# Altium schematic sheet Resistor - 261-312.SchDoc
size A0; SheetNumber: 7; SheetTotal: 14
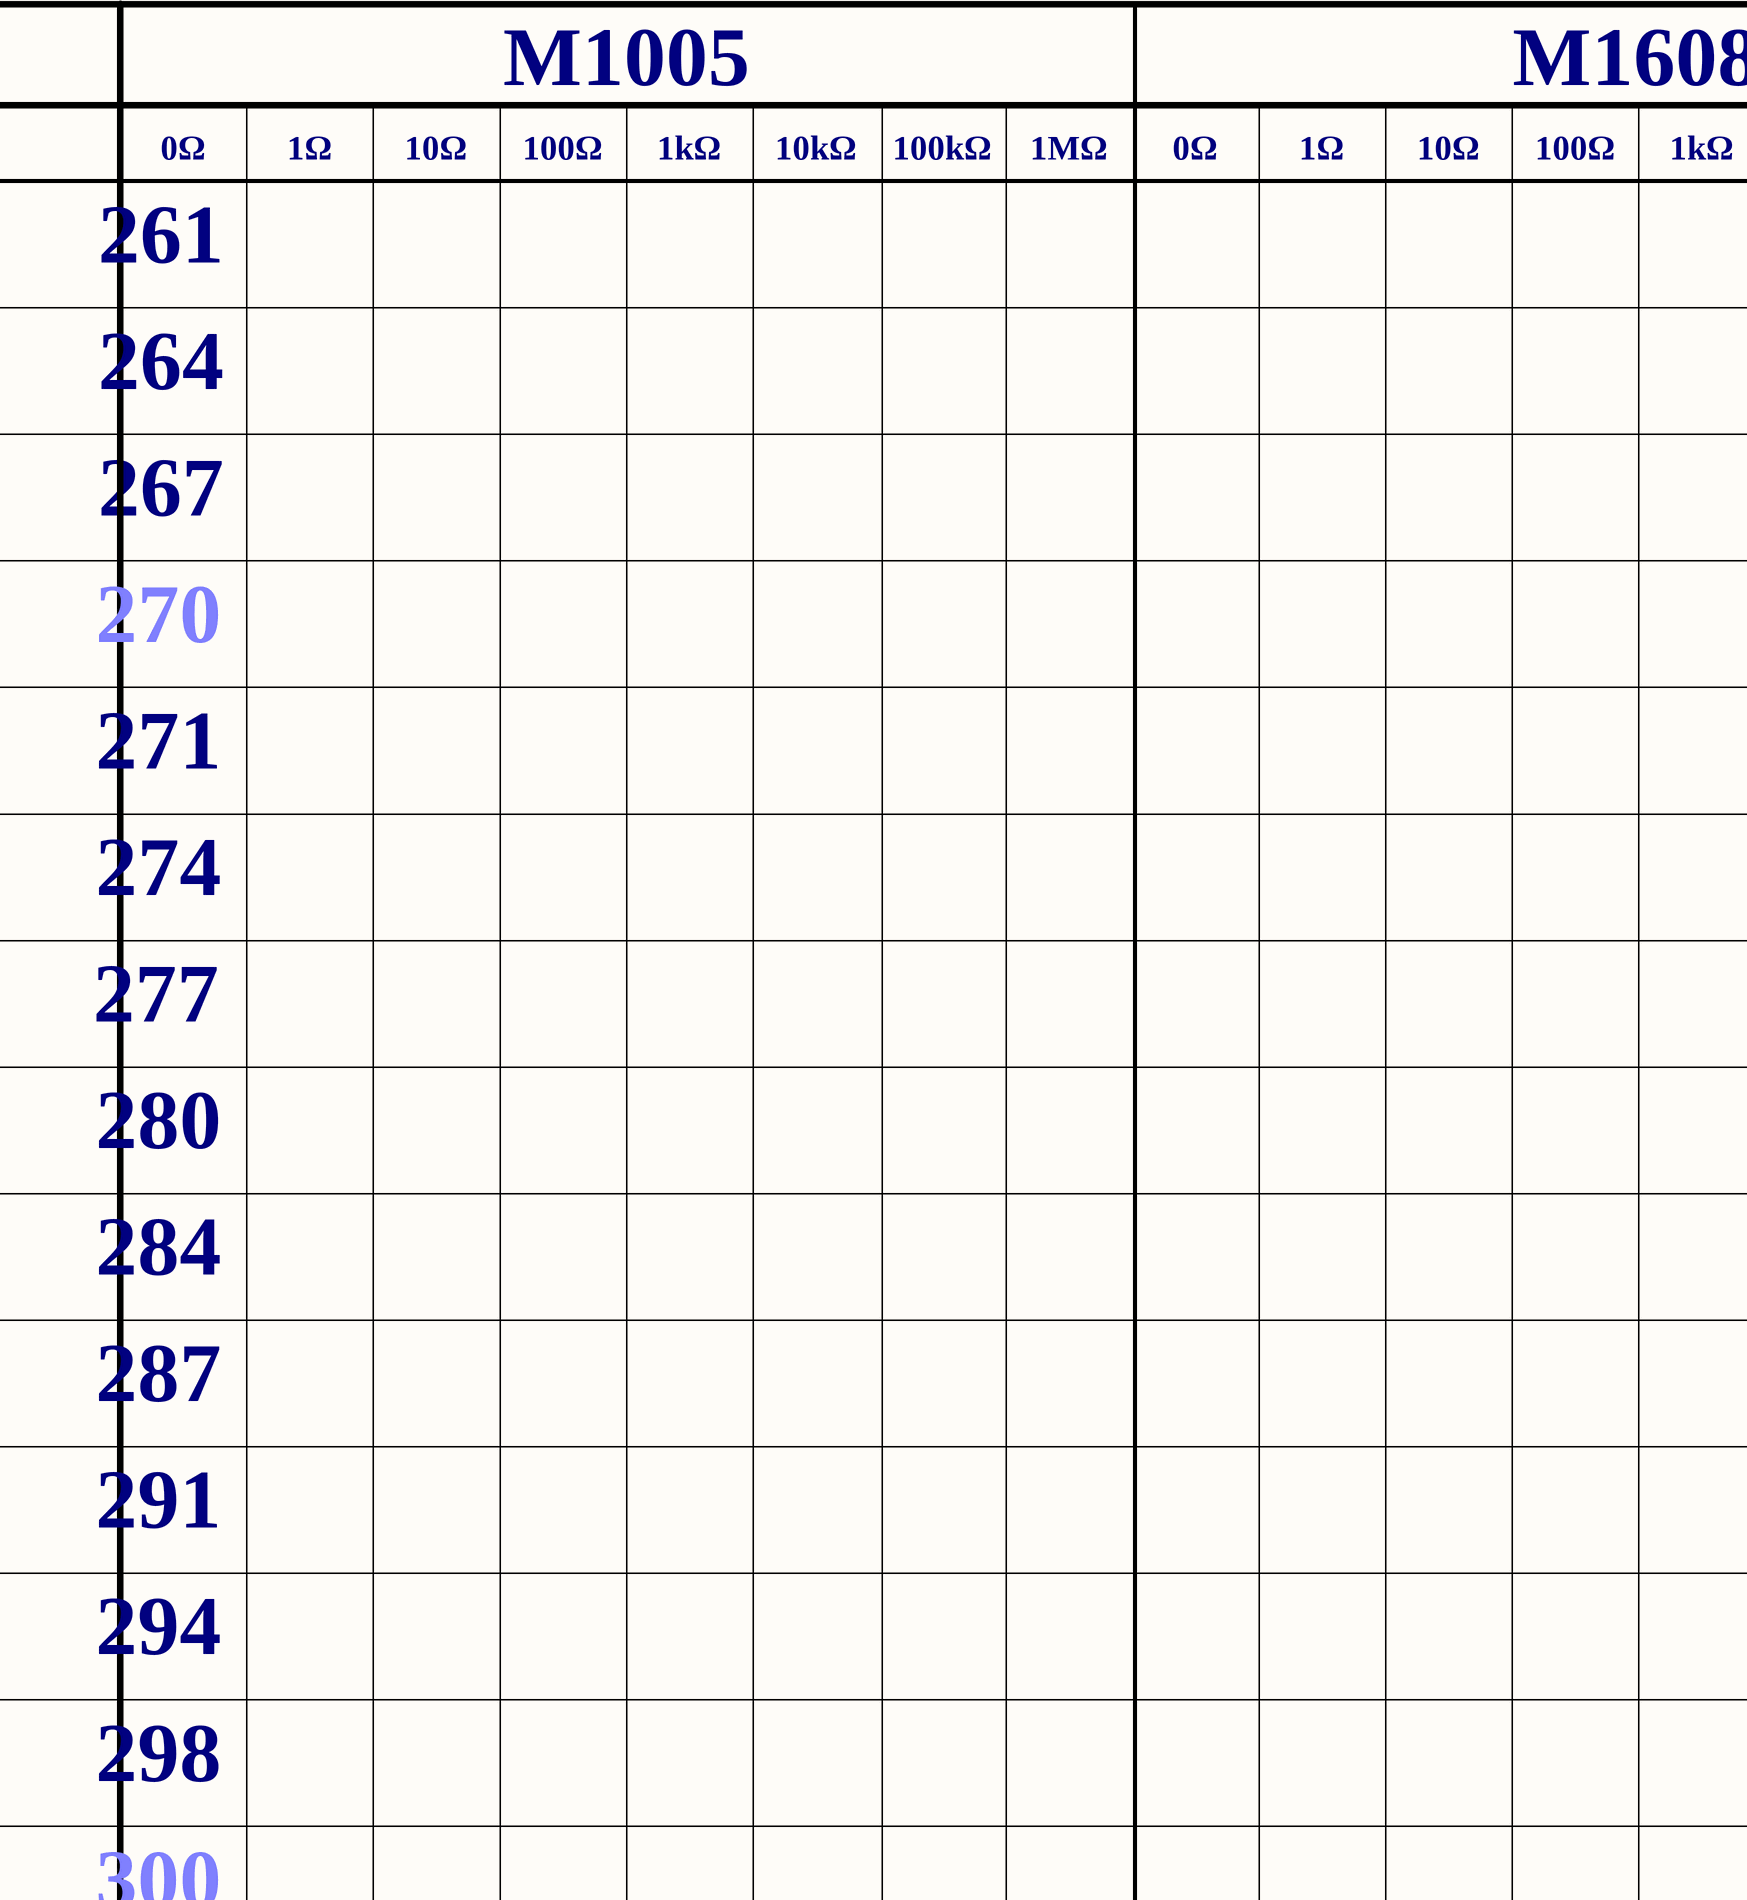
[diagram p0: Resistor - 261-312.SchDoc, top left]
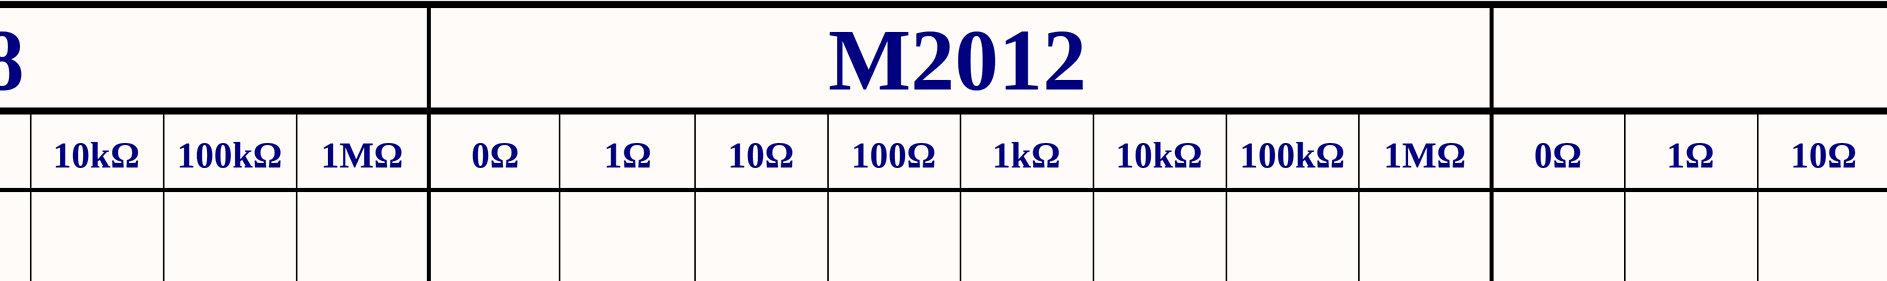
[diagram p1: Resistor - 261-312.SchDoc, top middle]
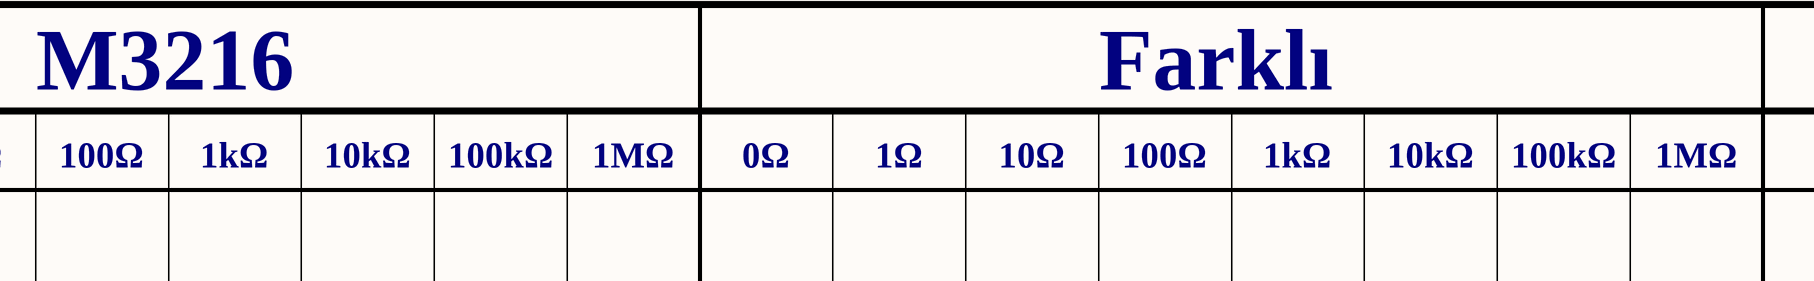
[diagram p2: Resistor - 261-312.SchDoc, top right]
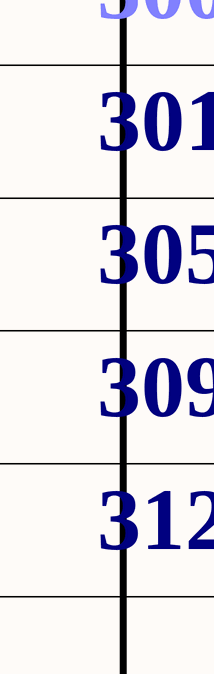
[diagram p3: Resistor - 261-312.SchDoc, bottom left]

## Notes on the sheet
- M1005
- M1608
- M2012
- M3216
- Farklı
- 0Ω
- 1Ω
- 10Ω
- 100Ω
- 1kΩ
- 10kΩ
- 100kΩ
- 1MΩ
- 261
- 264
- 267
- 270
- 271
- 274
- 277
- 280
- 284
- 287
- 291
- 294
- 298
- 300
- 301
- 305
- 309
- 312